# Altium schematic sheet Sheet2.SchDoc
size A4; SheetNumber: 3; SheetTotal: 3
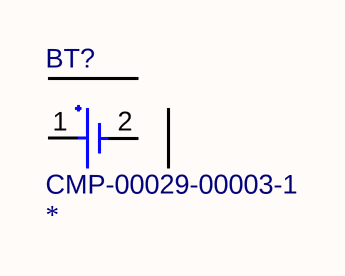
[diagram p0: Sheet2.SchDoc]

## Parts
BT?  CMP-00029-00003-1  [KEMT-T491-D_L]

## Nets

Not connected (* = marked no-connect by the designer): BT? 1(+) 2(-)

## Library data of the parts
BT? = CMP-00027-00011-1: Link 1: C:\Users\AllenNg\Desktop\Active Cases\00686628\Notes.txt; Link 2: C:\Users\AllenNg\Desktop\Active Cases\00686753\Mating_910260_RevA_Altium\Mating_910260_RevA_Altium\Project Outputs for Mating_910260_RevA\BOM\BOM_910260_RevA.pdf; Parameter 1: *; ComponentLink1Description: New link; Design Item ID: CMP-00029-00003-1; ComponentLink2URL: www.altium.com/documentation/altium-designer/working-with-schematic-libraries; ComponentLink1URL: https://www.altium.com/documentation/altium-designer/working-with-schematic-libraries; Min Operating Temperature: 1°C; Source: Parameter Import.SchLib; Max Operating Temperature: 1°C; Pins: 2; ComponentLink2Description: New Link 2; Link 3: https://www.altium.com/documentation/altium-designer/working-with-schematic-libraries; Component Type: Standard; Link 4: www.altium.com/documentation/altium-designer/working-with-schematic-libraries